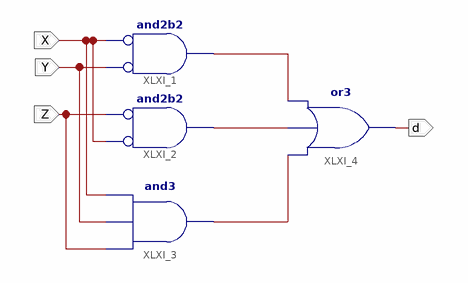
[diagram p0: schematic sheet 1]
// Xilinx ISE schematic circuitoD.sch (spartan3e) as structural Verilog: 4 symbols, 4 ports
module circuitoD (
  input  X,
  input  Y,
  input  Z,
  output d
);

  wire XLXN_1, XLXN_2, XLXN_3;

  and XLXI_1 (XLXN_1, ~Y, ~X);  // and2b2
  and XLXI_2 (XLXN_2, ~X, ~Z);  // and2b2
  and XLXI_3 (XLXN_3, Z, Y, X);
  or XLXI_4 (d, XLXN_3, XLXN_2, XLXN_1);
endmodule
